# EasyEDA Pro project ProPrj_光伏板清洁设备控制系统的设计_2026-05-10.epro

# Schematic Schematic1
Assembly Variant: Basic; Board Name: Board1; Create Date: 2026-04-20; Page Name: P1; Project Name: 光伏板清洁设备控制系统的设计; Schematic Name: Schematic1; Update Date: 2026-04-20; BladeWidth: 10; Company: 嘉立创EDA; Page Size: A4; RegionStart: 1; ShowBorder: 1; TitleBlock: 1; TitleBlockPosition: 3; Version: V1.0; XRegionCount: 6; YRegionCount: 4
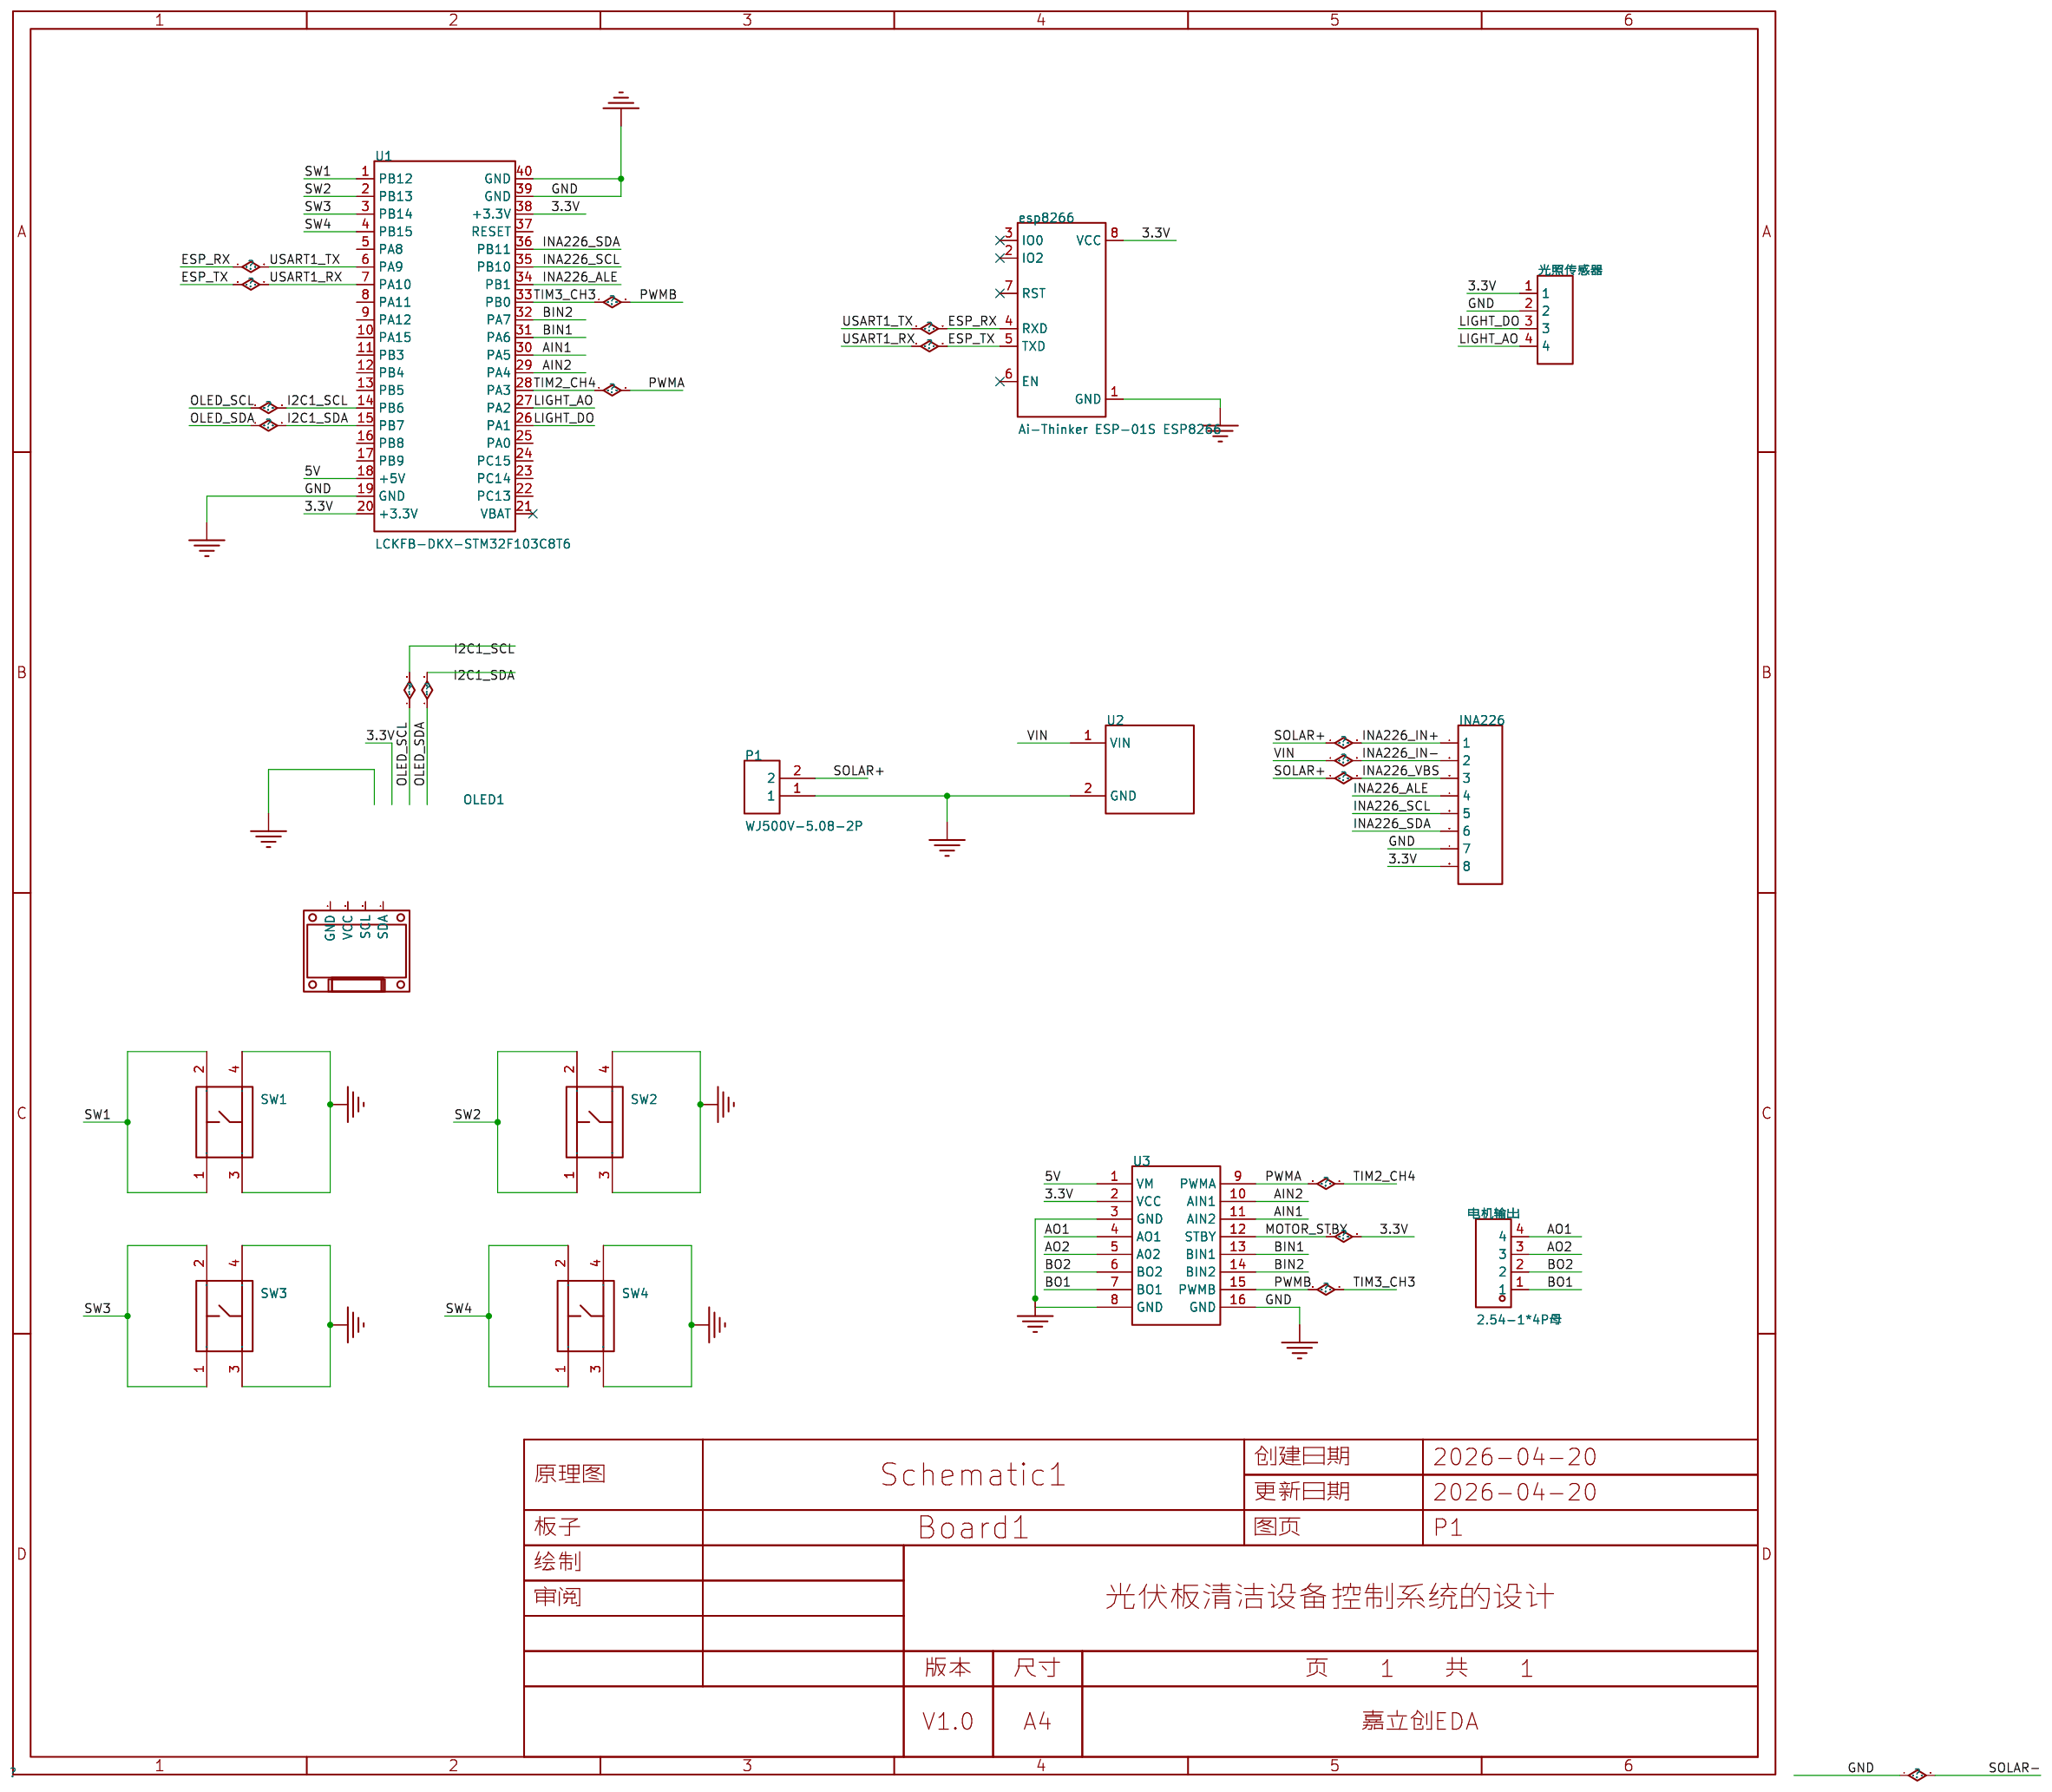
[diagram p0: schematic sheet]

## Parts
esp8266  Ai-Thinker ESP-01S ESP8266  [WIFIM-TH_8P-L24.7-W14.4-P2.54]
INA226  -  [HDR-TH_8P-P2.54-V-M]
OLED1  -  [0.96OLED_4P]
P1  WJ500V-5.08-2P  [CONN-TH_2P-P5.00_WJ500V-5.08-2P]
SW1  K2-1102DP-C4SW-04  [KEY-TH_4P-L6.0-W6.0-P4.50-LS6.50]
SW2  K2-1102DP-C4SW-04  [KEY-TH_4P-L6.0-W6.0-P4.50-LS6.50]
SW3  K2-1102DP-C4SW-04  [KEY-TH_4P-L6.0-W6.0-P4.50-LS6.50]
SW4  K2-1102DP-C4SW-04  [KEY-TH_4P-L6.0-W6.0-P4.50-LS6.50]
U1  LCKFB-DKX-STM32F103C8T6  [CONN-TH_L53.3-W22.9_STM32F103C8T6-CARD]
U2  -  [XL3163]
U3  -  [TB6612]
光照传感器  -  [HDR-TH_4P-P2.54-V-M]
电机输出  2.54-1*4P母  [HDR-TH_4P-P2.54-V-F]

## Library data of the parts
esp8266 = Ai-Thinker ESP-01S ESP8266: Supplier Part: C17606792; Manufacturer: Ai-Thinker(安信可); JLCPCB Part Class: Extended Part; Datasheet: https://item.szlcsc.com/datasheet/Ai-Thinker%2520ESP-01S%2520ESP8266/18736031.html; Supplier: LCSC
INA226 = HDR-M_2.54_1x8P: Supplier Part: C124381; Supplier Footprint: 插件
OLED1 = 0.96OLED模块_4P: Supplier Footprint: 插件
P1 = WJ500V-5.08-2P: 结构:1x2P;间距:5.08mm;颜色:绿色;安装方式:直插;额定电流:18A;额定电压:250V;排数:1;线规 - AWG:14~30;线规 - 平方毫米:2.5;每排PIN数:2;触头材质:-;触头镀层:-;工作温度范围:-40℃~+105℃;焊接温度(最大值):-;; LCSC Part Name: 1x2P 5.08mm 直插 排数:1 每排P数:2; Supplier Part: C8465; Manufacturer: KANGNEX(康奈克斯电气); Supplier Footprint: 插件,P=5.08mm; JLCPCB Part Class: Extended Part; Datasheet: https://atta.szlcsc.com/upload/public/pdf/source/20191225/C8465_02D34CE5B5B4A53DF5891601D97FA9F4.pdf; Supplier: LCSC; Structure: 1x2P; Pitch: 5.08mm; Color: 绿色; Mounting Style: 直插; Current Rating (Max): 18A; Voltage Rating (Max): 250V; Number of Pins: 2P; Number of Rows: 1; Wire Gauge - AWG: 14~30; Wire Gauge - mm2: 2.5; Number of PINs Per Row: 2; Operating Temperature Range: -40℃~+105℃; Screw Specification: M2.5
SW1-SW4 = K2-1102DP-C4SW-04: 电路结构:单刀单掷;按钮形状:圆形按钮;作用力:2.5N;安装方式:直插;开关长度:6mm;开关宽度:6mm;开关高度:5mm;触点电流:50mA;额定电压:12V;带灯:-;工作寿命:10万次;; LCSC Part Name: 轻触按键开关6*6*5; Supplier Part: C110153; Manufacturer: 韩国韩荣; Supplier Footprint: 插件-4P,6x6mm; JLCPCB Part Class: Extended Part; Datasheet: https://item.szlcsc.com/datasheet/K2-1102DP-C4SW-04/111374.html; Supplier: LCSC; Circuit: 单刀单掷; Actuator Style: 圆形按钮; Operating Force: 2.5N; Mounting Type: 直插; Length: 6mm; Width: 6mm; Switch Height: 5mm; Contact Current: 50mA; Voltage Rating: 12V; Life: 10万次; Operating Temperature: -25℃~+85℃
U1 = LCKFB-DKX-STM32F103C8T6: 搭载Contex M3内核,程序存储容量64KB,RAM总容量20KB,最高72MHz主频,提供高效的计算能力和稳定的运行环境。; LCSC Part Name: 立创·地阔星-STM32F103C8T6开发板; Supplier Part: C22396880; Manufacturer: 立创开发板; JLCPCB Part Class: Extended Part; Datasheet: https://item.szlcsc.com/datasheet/LCKFB-DKX-STM32F103C8T6/24005615.html; Supplier: LCSC
U2 = XL3163
U3 = TB6612
光照传感器 = HDR-M_2.54_1x4P: Supplier Part: C492403; Supplier Footprint: 插件
电机输出 = 2.54-1*4P母: 插孔结构:1x4P;间距:2.54mm;行距:-;圆孔/方孔:方孔;安装方式:直插;排数:单排;总孔位数:4P;额定电流:3A;额定电压:-;插孔方向:顶部;塑高:-;触头材质:青铜;触头镀层:-;工作温度:-40℃~+105℃;; LCSC Part Name: 间距:2.54mm 1x4P 直插; Supplier Part: C2718488; Manufacturer: BOOMELE(博穆精密); Supplier Footprint: 插件,P=2.54mm; JLCPCB Part Class: Extended Part; Datasheet: https://item.szlcsc.com/datasheet/2.54-1*4P%25E6%25AF%258D/2834502.html; Supplier: LCSC; Holes Structure: 1x4P; Pitch: 2.54mm; Circular Hole / Square Hole: 方孔; Mounting Type: 直插; Number of Rows: 单排; Number of Positions: 4P; Current Rating: 3A; Holes Direction: 顶部; Contact Material: 青铜; Operating Temperature: -40℃~+105℃

## Nets
3.3V: esp8266.8(VCC) INA226.8 U1.20(+3.3V) U1.38(+3.3V) U3.2(VCC) U3.12(STBY) 光照传感器.1
5V: U1.18(+5V) U3.1(VM)
GND: esp8266.1(GND) INA226.7 P1.1 SW1.3 SW1.4 SW2.3 SW2.4 SW3.3 SW3.4 SW4.3 SW4.4 U1.19(GND) U1.39(GND) U1.40(GND) U2.2(GND) U3.3(GND) U3.8(GND) U3.16(GND) 光照传感器.2
AIN1: U1.30(PA5) U3.11(AIN2)
AIN2: U1.29(PA4) U3.10(AIN1)
AO1: U3.4(AO1) 电机输出.4
AO2: U3.5(A02) 电机输出.3
BIN1: U1.31(PA6) U3.13(BIN1)
BIN2: U1.32(PA7) U3.14(BIN2)
BO1: U3.7(BO1) 电机输出.1
BO2: U3.6(BO2) 电机输出.2
ESP_RX: esp8266.4(RXD) U1.6(PA9)
ESP_TX: esp8266.5(TXD) U1.7(PA10)
I2C1_SCL: U1.14(PB6)
I2C1_SDA: U1.15(PB7)
INA226_ALE: INA226.4 U1.34(PB1)
INA226_IN+: INA226.1 INA226.3 P1.2
INA226_IN-: INA226.2 U2.1(VIN)
INA226_SCL: INA226.5 U1.35(PB10)
INA226_SDA: INA226.6 U1.36(PB11)
LIGHT_AO: U1.27(PA2) 光照传感器.4
LIGHT_DO: U1.26(PA1) 光照传感器.3
PWMA: U1.28(PA3) U3.9(PWMA)
PWMB: U1.33(PB0) U3.15(PWMB)
SW1: SW1.1 SW1.2 U1.1(PB12)
SW2: SW2.1 SW2.2 U1.2(PB13)
SW3: SW3.1 SW3.2 U1.3(PB14)
SW4: SW4.1 SW4.2 U1.4(PB15)

Not connected (* = marked no-connect by the designer): esp8266 2(IO2)* 3(IO0)* 6(EN)* 7(RST)*; OLED1 1(GND) 2(VCC) 3(SCL) 4(SDA); U1 5(PA8) 8(PA11) 9(PA12) 10(PA15) 11(PB3) 12(PB4) 13(PB5) 16(PB8) 17(PB9) 21(VBAT)* 22(PC13) 23(PC14) 24(PC15) 25(PA0) 37(RESET)

# Board PCB1
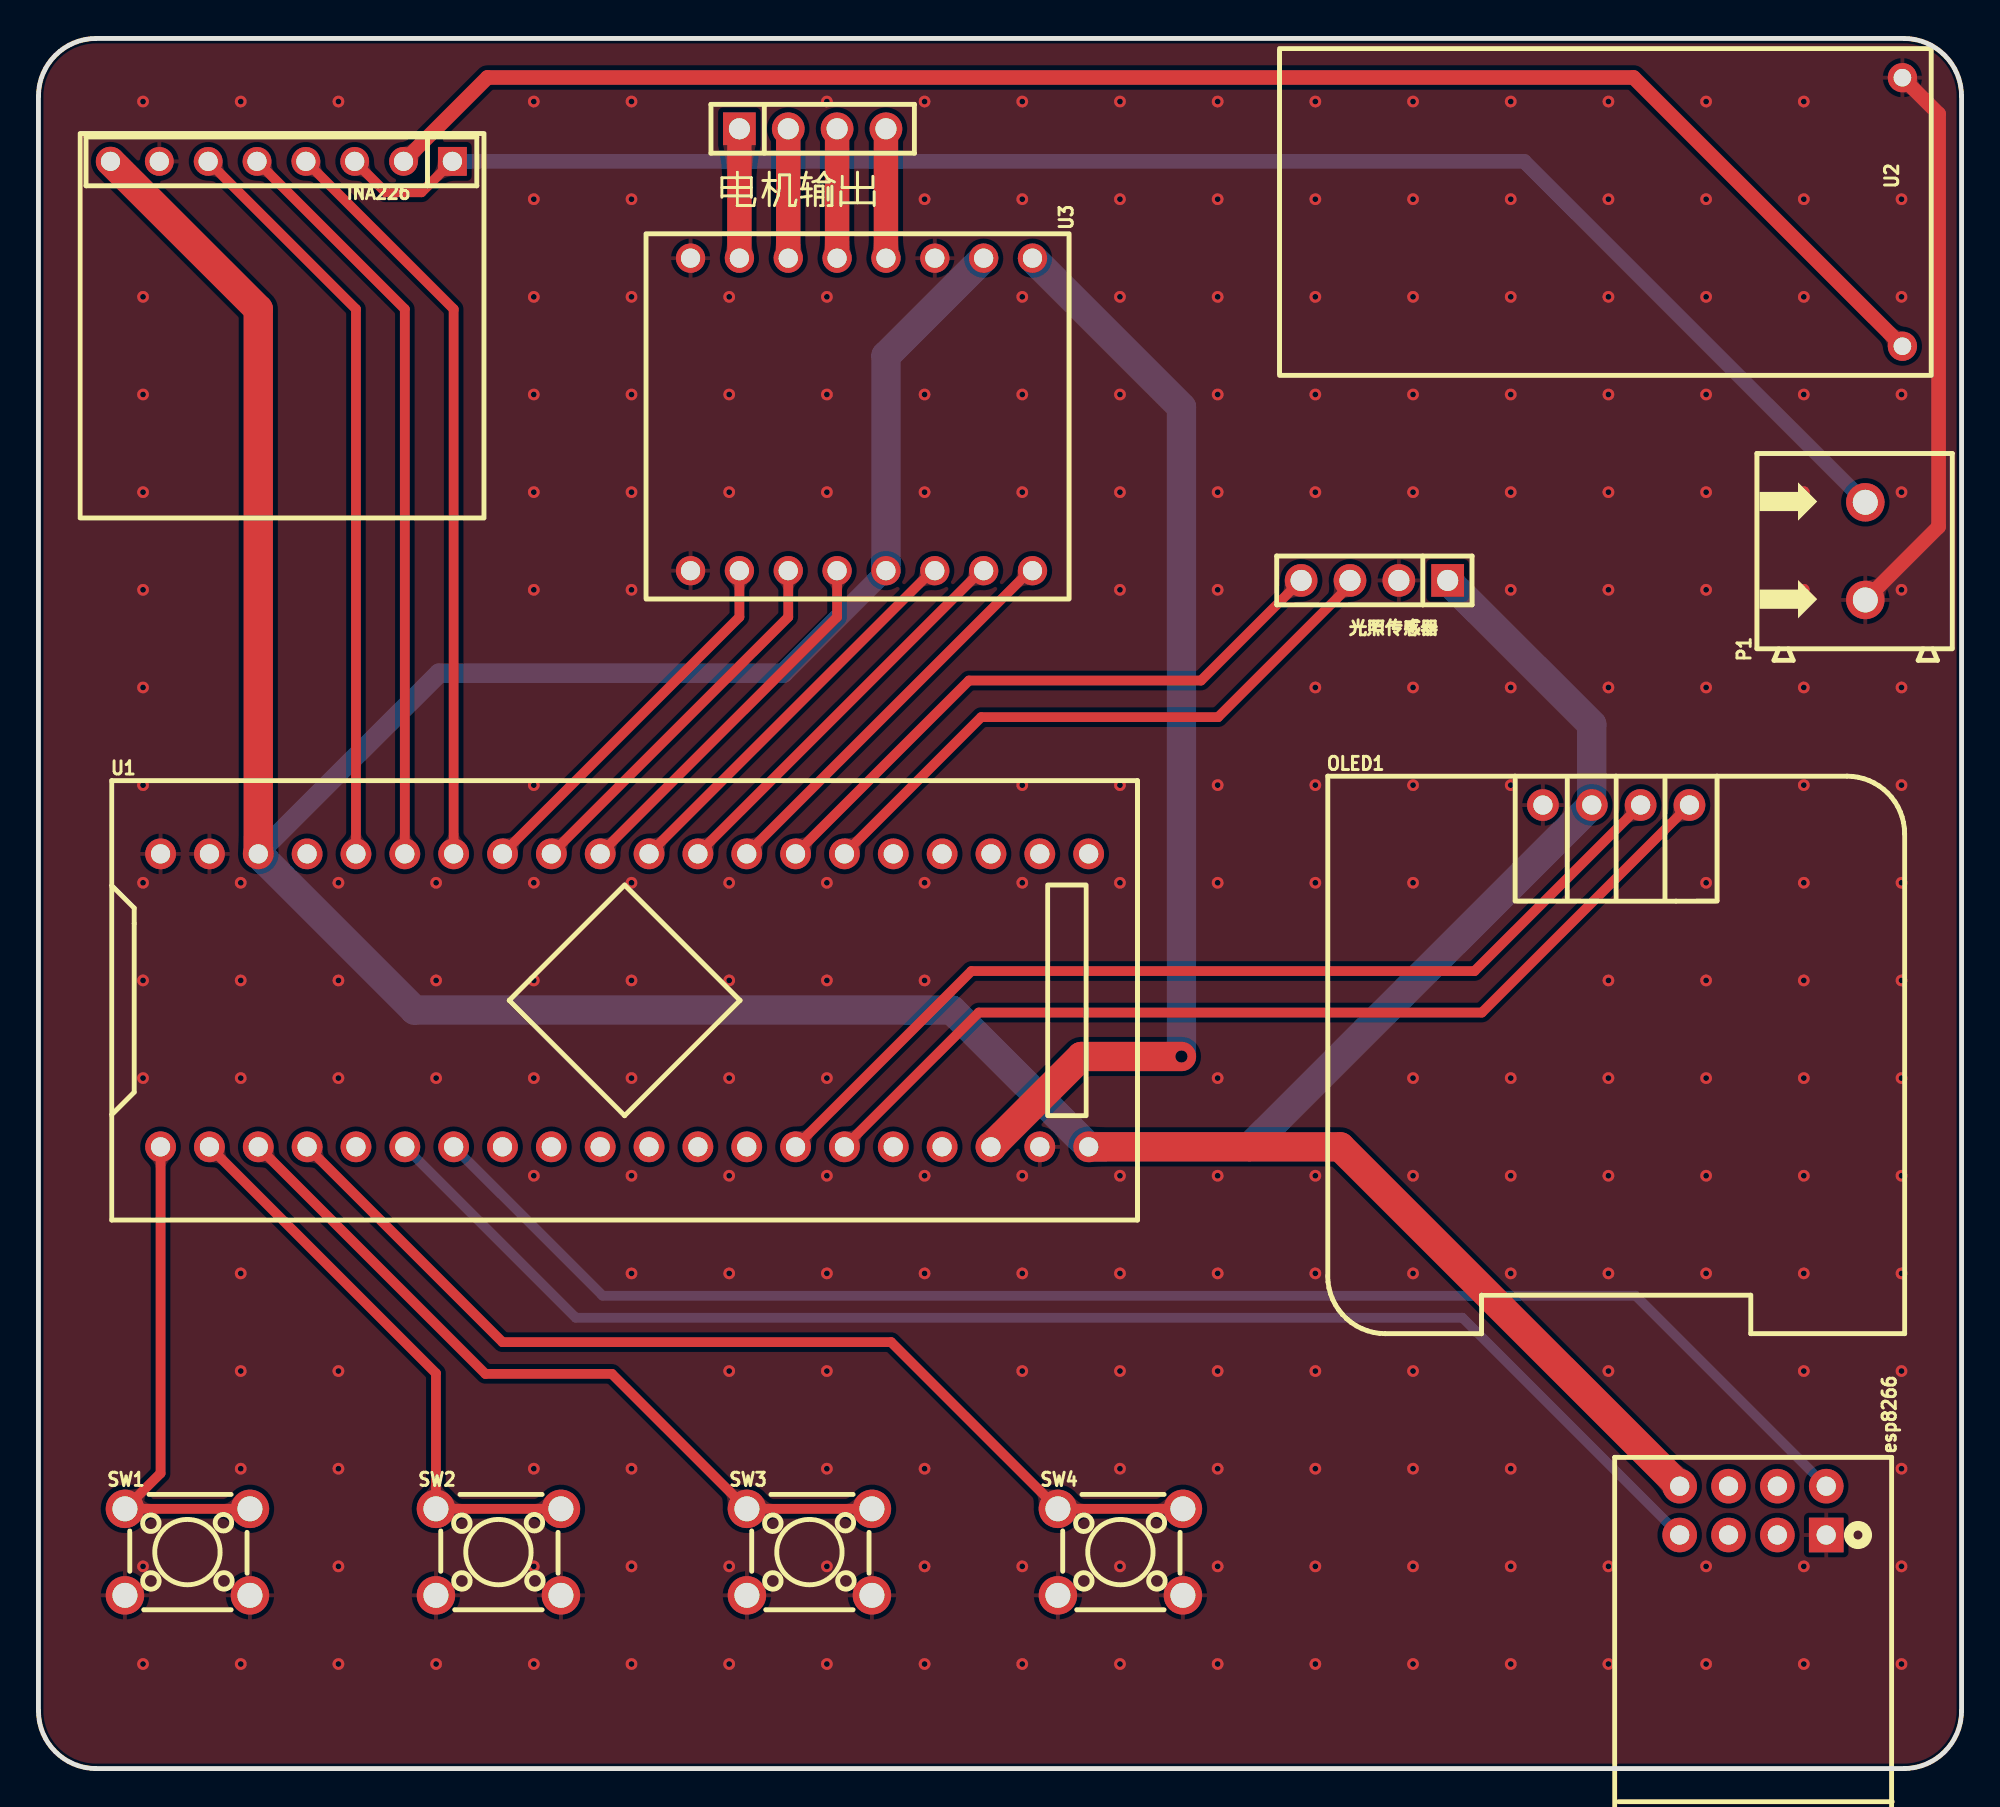
[diagram p1: board, top side]
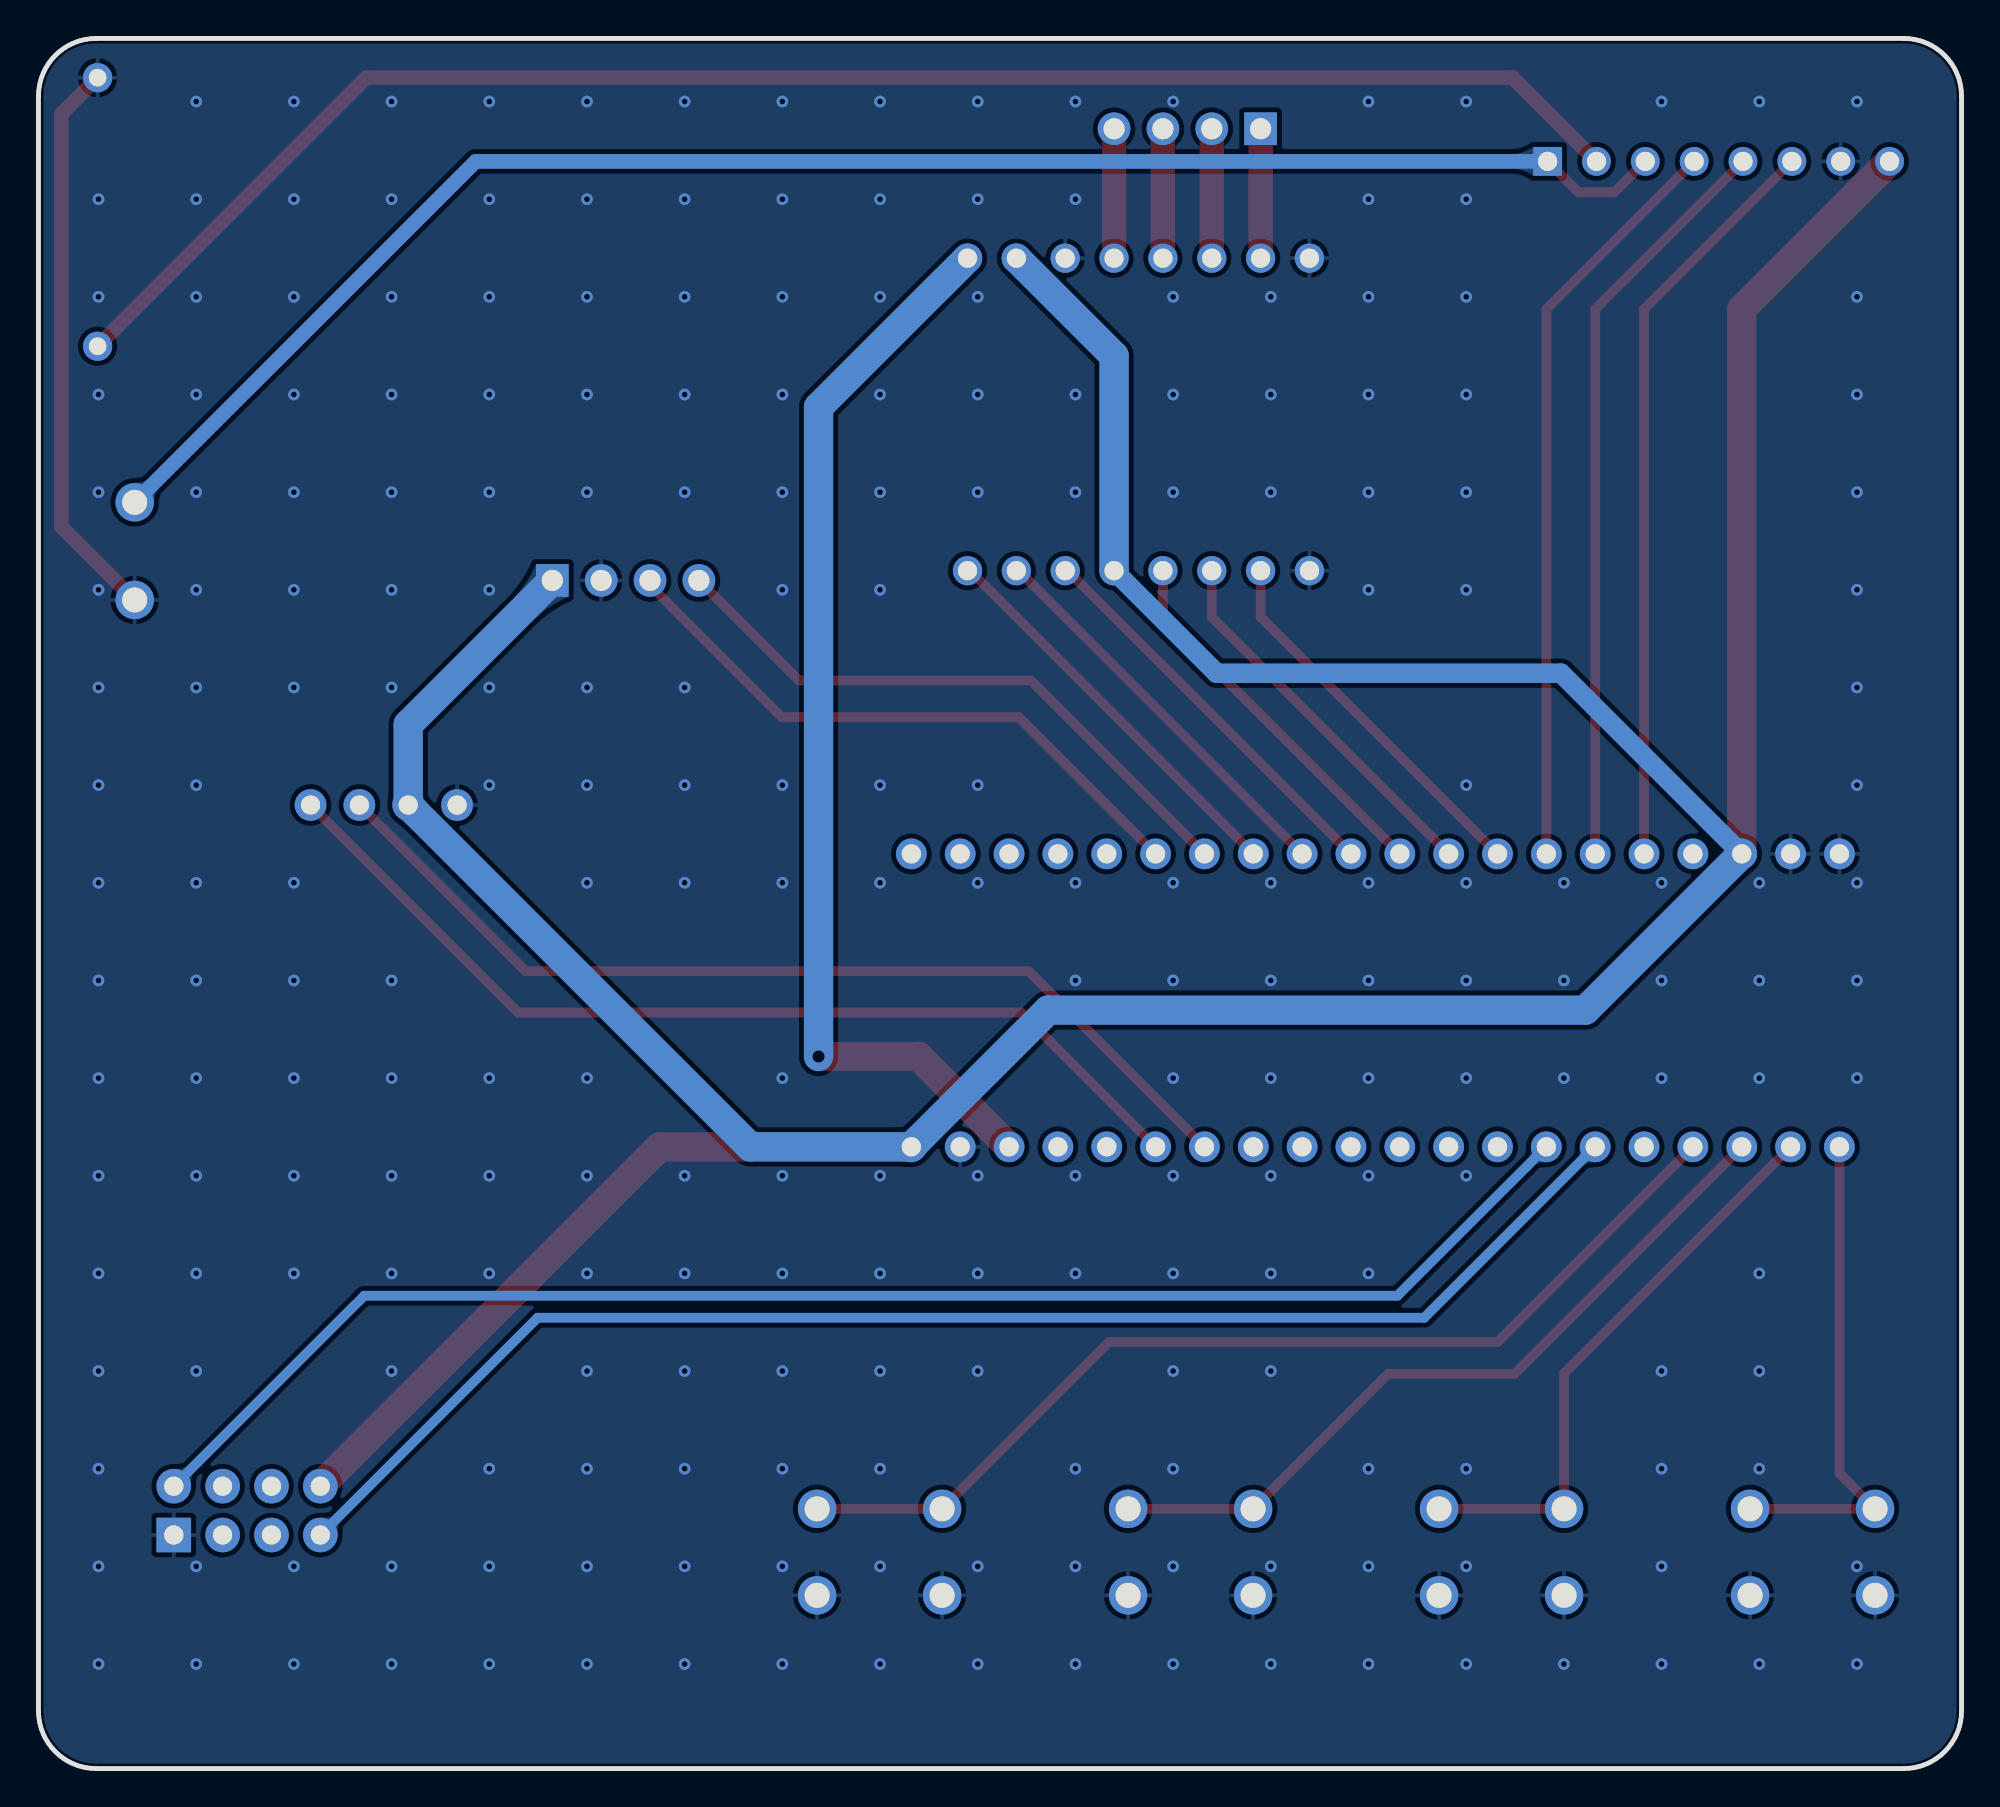
[diagram p2: board, bottom side, seen from below]

Outline 100 x 90 mm; copper layers: Top Layer, Bottom Layer. Coordinates in mm from the lower left corner of the outline.
Outline path: 0,87 0,3 arc(0.88,0.88) 3,0 97,0 arc(99.12,0.88) 100,3 100,87 arc(99.12,89.12) 97,90 3,90 arc(0.88,89.12) 0,87
Stack: Top Layer 0.035mm / Dielectric1 1.51mm FR4 er 4.5 / Bottom Layer 0.035mm

## Design rules (mm)
spacing copperThickness1oz (default): track to track 0.102, other pairs 0.152 to 0.3
spacing copperThickness2oz: track to track 0.203, other pairs 0.152 to 0.3
track width copperThickness1oz (default): min 0.127, default 0.254, max 2.54
track width copperThickness2oz: min 0.203, default 0.254, max 2.54
differential pair differentialPair (default): width min 0.127, default 0.254, max 2.54; gap min 0.152, default 0.152
net GND uses copperRegion

## Placement (name value [footprint] x y rotation side)
esp8266  Ai-Thinker ESP-01S ESP8266  [WIFIM-TH_8P-L24.7-W14.4-P2.54]  89.15 13.42 270 top
INA226  -  [HDR-TH_8P-P2.54-V-M]  12.63 83.61 180 top
OLED1  -  [0.96OLED_4P]  82.04 50.12 0 top
P1  WJ500V-5.08-2P  [CONN-TH_2P-P5.00_WJ500V-5.08-2P]  95 63.33 90 top
SW1  K2-1102DP-C4SW-04  [KEY-TH_4P-L6.0-W6.0-P4.50-LS6.50]  7.75 11.26 0 top
SW2  K2-1102DP-C4SW-04  [KEY-TH_4P-L6.0-W6.0-P4.50-LS6.50]  23.92 11.26 0 top
SW3  K2-1102DP-C4SW-04  [KEY-TH_4P-L6.0-W6.0-P4.50-LS6.50]  40.09 11.26 0 top
SW4  K2-1102DP-C4SW-04  [KEY-TH_4P-L6.0-W6.0-P4.50-LS6.50]  56.26 11.26 0 top
U1  LCKFB-DKX-STM32F103C8T6  [CONN-TH_L53.3-W22.9_STM32F103C8T6-CARD]  30.48 39.96 0 top
U2  -  [XL3163]  98.43 72.47 180 top
U3  -  [TB6612]  53.59 79.84 270 top
光照传感器  -  [HDR-TH_4P-P2.54-V-M]  69.47 61.81 180 top
电机输出  2.54-1*4P母  [HDR-TH_4P-P2.54-V-F]  40.26 85.3 0 top

## Footprints (pads in the part's own frame, mm; a bottom-side part is the same pattern mirrored in y, then rotated)
0.96OLED_4P
  round 1.65 hole 1: 1(-3.81,-0.002) 2(-1.27,0.002) 3(1.27,0.002) 4(3.81,0.002)
CONN-TH_2P-P5.00_WJ500V-5.08-2P
  round 2 hole 1.3: 1(-2.54,0) 2(2.54,0)
CONN-TH_L53.3-W22.9_STM32F103C8T6-CARD
  round 1.6 hole 1: 1(-24.13,-7.62) 2(-21.59,-7.62) 3(-19.05,-7.62) 4(-16.51,-7.62) 5(-13.97,-7.62) 6(-11.43,-7.62) 7(-8.89,-7.62) 8(-6.35,-7.62) 9(-3.81,-7.62) 10(-1.27,-7.62) 11(1.27,-7.62) 12(3.81,-7.62) 13(6.35,-7.62) 14(8.89,-7.62) 15(11.43,-7.62) 16(13.97,-7.62) 17(16.51,-7.62) 18(19.05,-7.62) 19(21.59,-7.62) 20(24.13,-7.62) 21(24.13,7.62) 22(21.59,7.62) 23(19.05,7.62) 24(16.51,7.62) 25(13.97,7.62) 26(11.43,7.62) 27(8.89,7.62) 28(6.35,7.62) 29(3.81,7.62) 30(1.27,7.62) 31(-1.27,7.62) 32(-3.81,7.62) 33(-6.35,7.62) 34(-8.89,7.62) 35(-11.43,7.62) 36(-13.97,7.62) 37(-16.51,7.62) 38(-19.05,7.62) 39(-21.59,7.62) 40(-24.13,7.62)
HDR-TH_4P-P2.54-V-F
  rect 1.7x1.7 hole 1.1: 1(-3.81,0)
  round 1.7 hole 1.1: 2(-1.27,0) 3(1.27,0) 4(3.81,0)
HDR-TH_4P-P2.54-V-M
  rect 1.7x1.7 hole 1.1: 1(-3.81,0)
  round 1.7 hole 1.1: 2(-1.27,0) 3(1.27,0) 4(3.81,0)
HDR-TH_8P-P2.54-V-M
  rect 1.5x1.5 hole 1: 1(-8.89,0)
  round 1.5 hole 1: 2(-6.35,0) 3(-3.81,0) 4(-1.27,0) 5(1.27,0) 6(3.81,0) 7(6.35,0) 8(8.89,0)
KEY-TH_4P-L6.0-W6.0-P4.50-LS6.50
  round 2 hole 1.3: 1(-3.25,2.25) 2(3.25,2.25) 3(-3.25,-2.25) 4(3.25,-2.25)
TB6612
  round 1.524 hole 1: 1(1.27,-1.905) 2(1.27,-4.445) 3(1.27,-6.985) 4(1.27,-9.525) 5(1.27,-12.065) 6(1.27,-14.605) 7(1.27,-17.145) 8(1.27,-19.685) 9(17.526,-1.905) 10(17.526,-4.445) 11(17.526,-6.985) 12(17.526,-9.525) 13(17.526,-12.065) 14(17.526,-14.605) 15(17.526,-17.145) 16(17.526,-19.685)
WIFIM-TH_8P-L24.7-W14.4-P2.54
  rect 1.8x1.8 hole 1: 1(1.27,3.81)
  round 1.8 hole 1: 2(1.27,1.27) 3(1.27,-1.27) 4(1.27,-3.81) 5(-1.27,3.81) 6(-1.27,1.27) 7(-1.27,-1.27) 8(-1.27,-3.81)
XL3163
  round 1.524 hole 0.914: 1(1.5,-1.515) 2(1.5,-15.485)

## Nets
As in the schematic, except:
3.3V: esp8266.8 INA226.8 OLED1.2 U1.20 U1.38 U3.2 U3.12 光照传感器.1
GND: esp8266.1 INA226.7 OLED1.1 P1.1 SW1.3 SW1.4 SW2.3 SW2.4 SW3.3 SW3.4 SW4.3 SW4.4 U1.19 U1.39 U1.40 U2.2 U3.3 U3.8 U3.16 光照传感器.2
I2C1_SCL: OLED1.3 U1.14
I2C1_SDA: OLED1.4 U1.15

Pads without a net: esp8266 2 3 6 7; U1 5 8 9 10 11 12 13 16 17 21 22 23 24 25 37

## Via types
v1: diameter 0.61, hole 0.305, Top Layer to Bottom Layer, 239 vias
v2: diameter 1.27, hole 0.635, Top Layer to Bottom Layer, 1 via

## Routing (per net, layer and track width the routed paths; a pad name or vN(x,y) marks a point on that pad's centre or on a via; arc(x,y) is an arc through that point)
3.3V: length 232.2
  Top Layer w1.524: 85.34,14.69 67.69,32.34 U1.20 ; U1.38 11.43,75.92 INA226.8
  Bottom Layer w1.016: U1.38 20.83,56.98 38.74,56.98 U3.12
  Bottom Layer w1.524: U1.38 19.56,39.45 47.5,39.45 U1.20 62.99,32.34 OLED1.2 80.77,54.31 光照传感器.1 ; U3.2 44.07,73.49 U3.12
5V: length 56.6
  Top Layer w1.524: U1.18 54.23,37.04 v2(59.44,37.04)
  Bottom Layer w1.524: v2(59.44,37.04) 59.44,70.82 U3.1
GND: length 29.5
  Top Layer w0.762: P1.1 98.81,64.6 98.81,86.08 U2.2
  vias: v1(5.44,86.72) v1(5.44,76.56) v1(5.44,71.48) v1(5.44,66.4) v1(5.44,61.32) v1(5.44,56.24) v1(5.44,51.16) v1(5.44,46.08) v1(5.44,41) v1(5.44,35.92) v1(5.44,10.52) v1(5.44,5.44) v1(10.52,86.72) v1(10.52,46.08) v1(10.52,41) v1(10.52,35.92) v1(10.52,25.76) v1(10.52,20.68) v1(10.52,15.6) v1(10.52,5.44) v1(15.6,86.72) v1(15.6,46.08) v1(15.6,41) v1(15.6,35.92) v1(15.6,20.68) v1(15.6,15.6) v1(15.6,10.52) v1(15.6,5.44) v1(20.68,46.08) v1(20.68,41) v1(20.68,35.92) v1(20.68,5.44) v1(25.76,86.72) v1(25.76,81.64) v1(25.76,76.56) v1(25.76,71.48) v1(25.76,66.4) v1(25.76,61.32) v1(25.76,51.16) v1(25.76,46.08) v1(25.76,41) v1(25.76,35.92) v1(25.76,30.84) v1(25.76,15.6) v1(25.76,10.52) v1(25.76,5.44) v1(30.84,86.72) v1(30.84,81.64) v1(30.84,76.56) v1(30.84,71.48) v1(30.84,66.4) v1(30.84,61.32) v1(30.84,46.08) v1(30.84,41) v1(30.84,35.92) v1(30.84,30.84) v1(30.84,25.76) v1(30.84,15.6) v1(30.84,10.52) v1(30.84,5.44) v1(35.92,76.56) v1(35.92,71.48) v1(35.92,66.4) v1(35.92,46.08) v1(35.92,41) v1(35.92,35.92) v1(35.92,30.84) v1(35.92,25.76) v1(35.92,20.68) v1(35.92,10.52) v1(35.92,5.44) v1(41,86.72) v1(41,76.56) v1(41,71.48) v1(41,66.4) v1(41,46.08) v1(41,41) v1(41,35.92) v1(41,30.84) v1(41,25.76) v1(41,20.68) v1(41,15.6) v1(41,10.52) v1(41,5.44) v1(46.08,86.72) v1(46.08,81.64) v1(46.08,71.48) v1(46.08,66.4) v1(46.08,46.08) v1(46.08,41) v1(46.08,30.84) v1(46.08,25.76) v1(46.08,15.6) v1(46.08,10.52) v1(46.08,5.44) v1(51.16,86.72) v1(51.16,81.64) v1(51.16,76.56) v1(51.16,71.48) v1(51.16,66.4) v1(51.16,51.16) v1(51.16,46.08) v1(51.16,30.84) v1(51.16,25.76) v1(51.16,20.68) v1(51.16,10.52) v1(51.16,5.44) v1(56.24,86.72) v1(56.24,81.64) v1(56.24,76.56) v1(56.24,71.48) v1(56.24,66.4) v1(56.24,61.32) v1(56.24,51.16) v1(56.24,46.08) v1(56.24,30.84) v1(56.24,25.76) v1(56.24,20.68) v1(56.24,15.6) v1(56.24,10.52) v1(56.24,5.44) v1(61.32,86.72) v1(61.32,81.64) v1(61.32,76.56) v1(61.32,71.48) v1(61.32,66.4) v1(61.32,61.32) v1(61.32,51.16) v1(61.32,46.08) v1(61.32,35.92) v1(61.32,30.84) v1(61.32,25.76) v1(61.32,20.68) v1(61.32,15.6) v1(61.32,10.52) v1(61.32,5.44) v1(66.4,86.72) v1(66.4,81.64) v1(66.4,76.56) v1(66.4,71.48) v1(66.4,66.4) v1(66.4,56.24) v1(66.4,51.16) v1(66.4,46.08) v1(66.4,30.84) v1(66.4,25.76) v1(66.4,20.68) v1(66.4,15.6) v1(66.4,10.52) v1(66.4,5.44) v1(71.48,86.72) v1(71.48,81.64) v1(71.48,76.56) v1(71.48,71.48) v1(71.48,66.4) v1(71.48,56.24) v1(71.48,51.16) v1(71.48,46.08) v1(71.48,35.92) v1(71.48,30.84) v1(71.48,25.76) v1(71.48,20.68) v1(71.48,15.6) v1(71.48,10.52) v1(71.48,5.44) v1(76.56,86.72) v1(76.56,81.64) v1(76.56,76.56) v1(76.56,71.48) v1(76.56,66.4) v1(76.56,61.32) v1(76.56,56.24) v1(76.56,51.16) v1(76.56,35.92) v1(76.56,30.84) v1(76.56,25.76) v1(76.56,15.6) v1(76.56,10.52) v1(76.56,5.44) v1(81.64,86.72) v1(81.64,81.64) v1(81.64,76.56) v1(81.64,71.48) v1(81.64,66.4) v1(81.64,61.32) v1(81.64,56.24) v1(81.64,41) v1(81.64,35.92) v1(81.64,30.84) v1(81.64,25.76) v1(81.64,20.68) v1(81.64,10.52) v1(81.64,5.44) v1(86.72,86.72) v1(86.72,81.64) v1(86.72,76.56) v1(86.72,71.48) v1(86.72,66.4) v1(86.72,61.32) v1(86.72,56.24) v1(86.72,46.08) v1(86.72,41) v1(86.72,35.92) v1(86.72,30.84) v1(86.72,25.76) v1(86.72,10.52) v1(86.72,5.44) v1(91.8,86.72) v1(91.8,81.64) v1(91.8,76.56) v1(91.8,71.48) v1(91.8,66.4) v1(91.8,61.32) v1(91.8,56.24) v1(91.8,51.16) v1(91.8,46.08) v1(91.8,41) v1(91.8,35.92) v1(91.8,30.84) v1(91.8,25.76) v1(91.8,20.68) v1(91.8,10.52) v1(91.8,5.44) v1(96.88,81.64) v1(96.88,76.56) v1(96.88,71.48) v1(96.88,66.4) v1(96.88,61.32) v1(96.88,56.24) v1(96.88,51.16) v1(96.88,46.08) v1(96.88,41) v1(96.88,35.92) v1(96.88,30.84) v1(96.88,25.76) v1(96.88,20.68) v1(96.88,15.6) v1(96.88,10.52) v1(96.88,5.44)
AIN1: length 21
  Top Layer w0.508: U3.11 46.48,62.31 U1.30
AIN2: length 21
  Top Layer w0.508: U3.10 49.02,62.31 U1.29
AO1: length 6.7
  Top Layer w1.27: 电机输出.4 U3.4
AO2: length 6.7
  Top Layer w1.27: U3.5 电机输出.3
BIN1: length 19.8
  Top Layer w0.508: U1.31 41.53,59.9 U3.13
BIN2: length 19.8
  Top Layer w0.508: U1.32 38.99,59.9 U3.14
BO1: length 6.7
  Top Layer w1.27: U3.7 电机输出.1
BO2: length 6.7
  Top Layer w1.27: 电机输出.2 U3.6
ESP_RX: length 74.7
  Bottom Layer w0.508: U1.6 27.94,23.45 74.04,23.45 esp8266.4
ESP_TX: length 78.7
  Bottom Layer w0.508: U1.7 29.34,24.59 83.06,24.59 92.96,14.69
I2C1_SCL: length 51.3
  Top Layer w0.508: OLED1.3 74.67,41.49 48.51,41.49 U1.14
I2C1_SDA: length 51.3
  Top Layer w0.508: U1.15 48.9,39.33 75.06,39.33 OLED1.4
INA226_ALE: length 39.2
  Top Layer w0.508: INA226.4 21.59,75.92 U1.34
INA226_IN+: length 87.2
  Top Layer w0.508: INA226.1 19.92,82 18.05,82 INA226.3
  Bottom Layer w0.762: P1.2 77.26,83.61 INA226.1
INA226_IN-: length 85.5
  Top Layer w0.762: U2.1 82.95,87.97 23.35,87.97 INA226.2
INA226_SCL: length 39.2
  Top Layer w0.508: U1.35 19.05,75.92 INA226.5
INA226_SDA: length 39.2
  Top Layer w0.508: INA226.6 16.51,75.92 U1.36
LIGHT_AO: length 32.2
  Top Layer w0.508: U1.27 48.39,56.6 60.45,56.6 光照传感器.4
LIGHT_DO: length 32.3
  Top Layer w0.508: 68.2,61.81 68.2,61.55 61.34,54.69 49.02,54.69 U1.26
PWMA: length 21
  Top Layer w0.508: U3.9 51.56,62.31 U1.28
PWMB: length 19.8
  Top Layer w0.508: U1.33 36.45,59.9 U3.15
SW1: length 26.1
  Top Layer w0.508: SW1.2 SW1.1 6.35,15.36 U1.1
SW2: length 30.2
  Top Layer w0.508: U1.2 20.67,20.56 SW2.1 SW2.2
SW3: length 39.7
  Top Layer w0.508: SW3.2 SW3.1 29.82,20.53 23.24,20.53 U1.3
SW4: length 53.3
  Top Layer w0.508: U1.4 24.13,22.18 44.34,22.18 SW4.1 SW4.2

## Copper pours and planes (outline as drawn; the poured copper is in the pictures)
GND on Top Layer: -39.62,114.77 197.99,114.77 197.99,-50.34 -39.62,-50.34
GND on Bottom Layer: -17.14,100.92 127.63,100.92 127.63,-13.63 -17.14,-13.63

Small or netless copper shapes (teardrops, artwork), in the pictures only: 60 on Top Layer, 13 on Bottom Layer
